# Altium project IR_SCOOTER.PrjPcb (part 4 of 4)
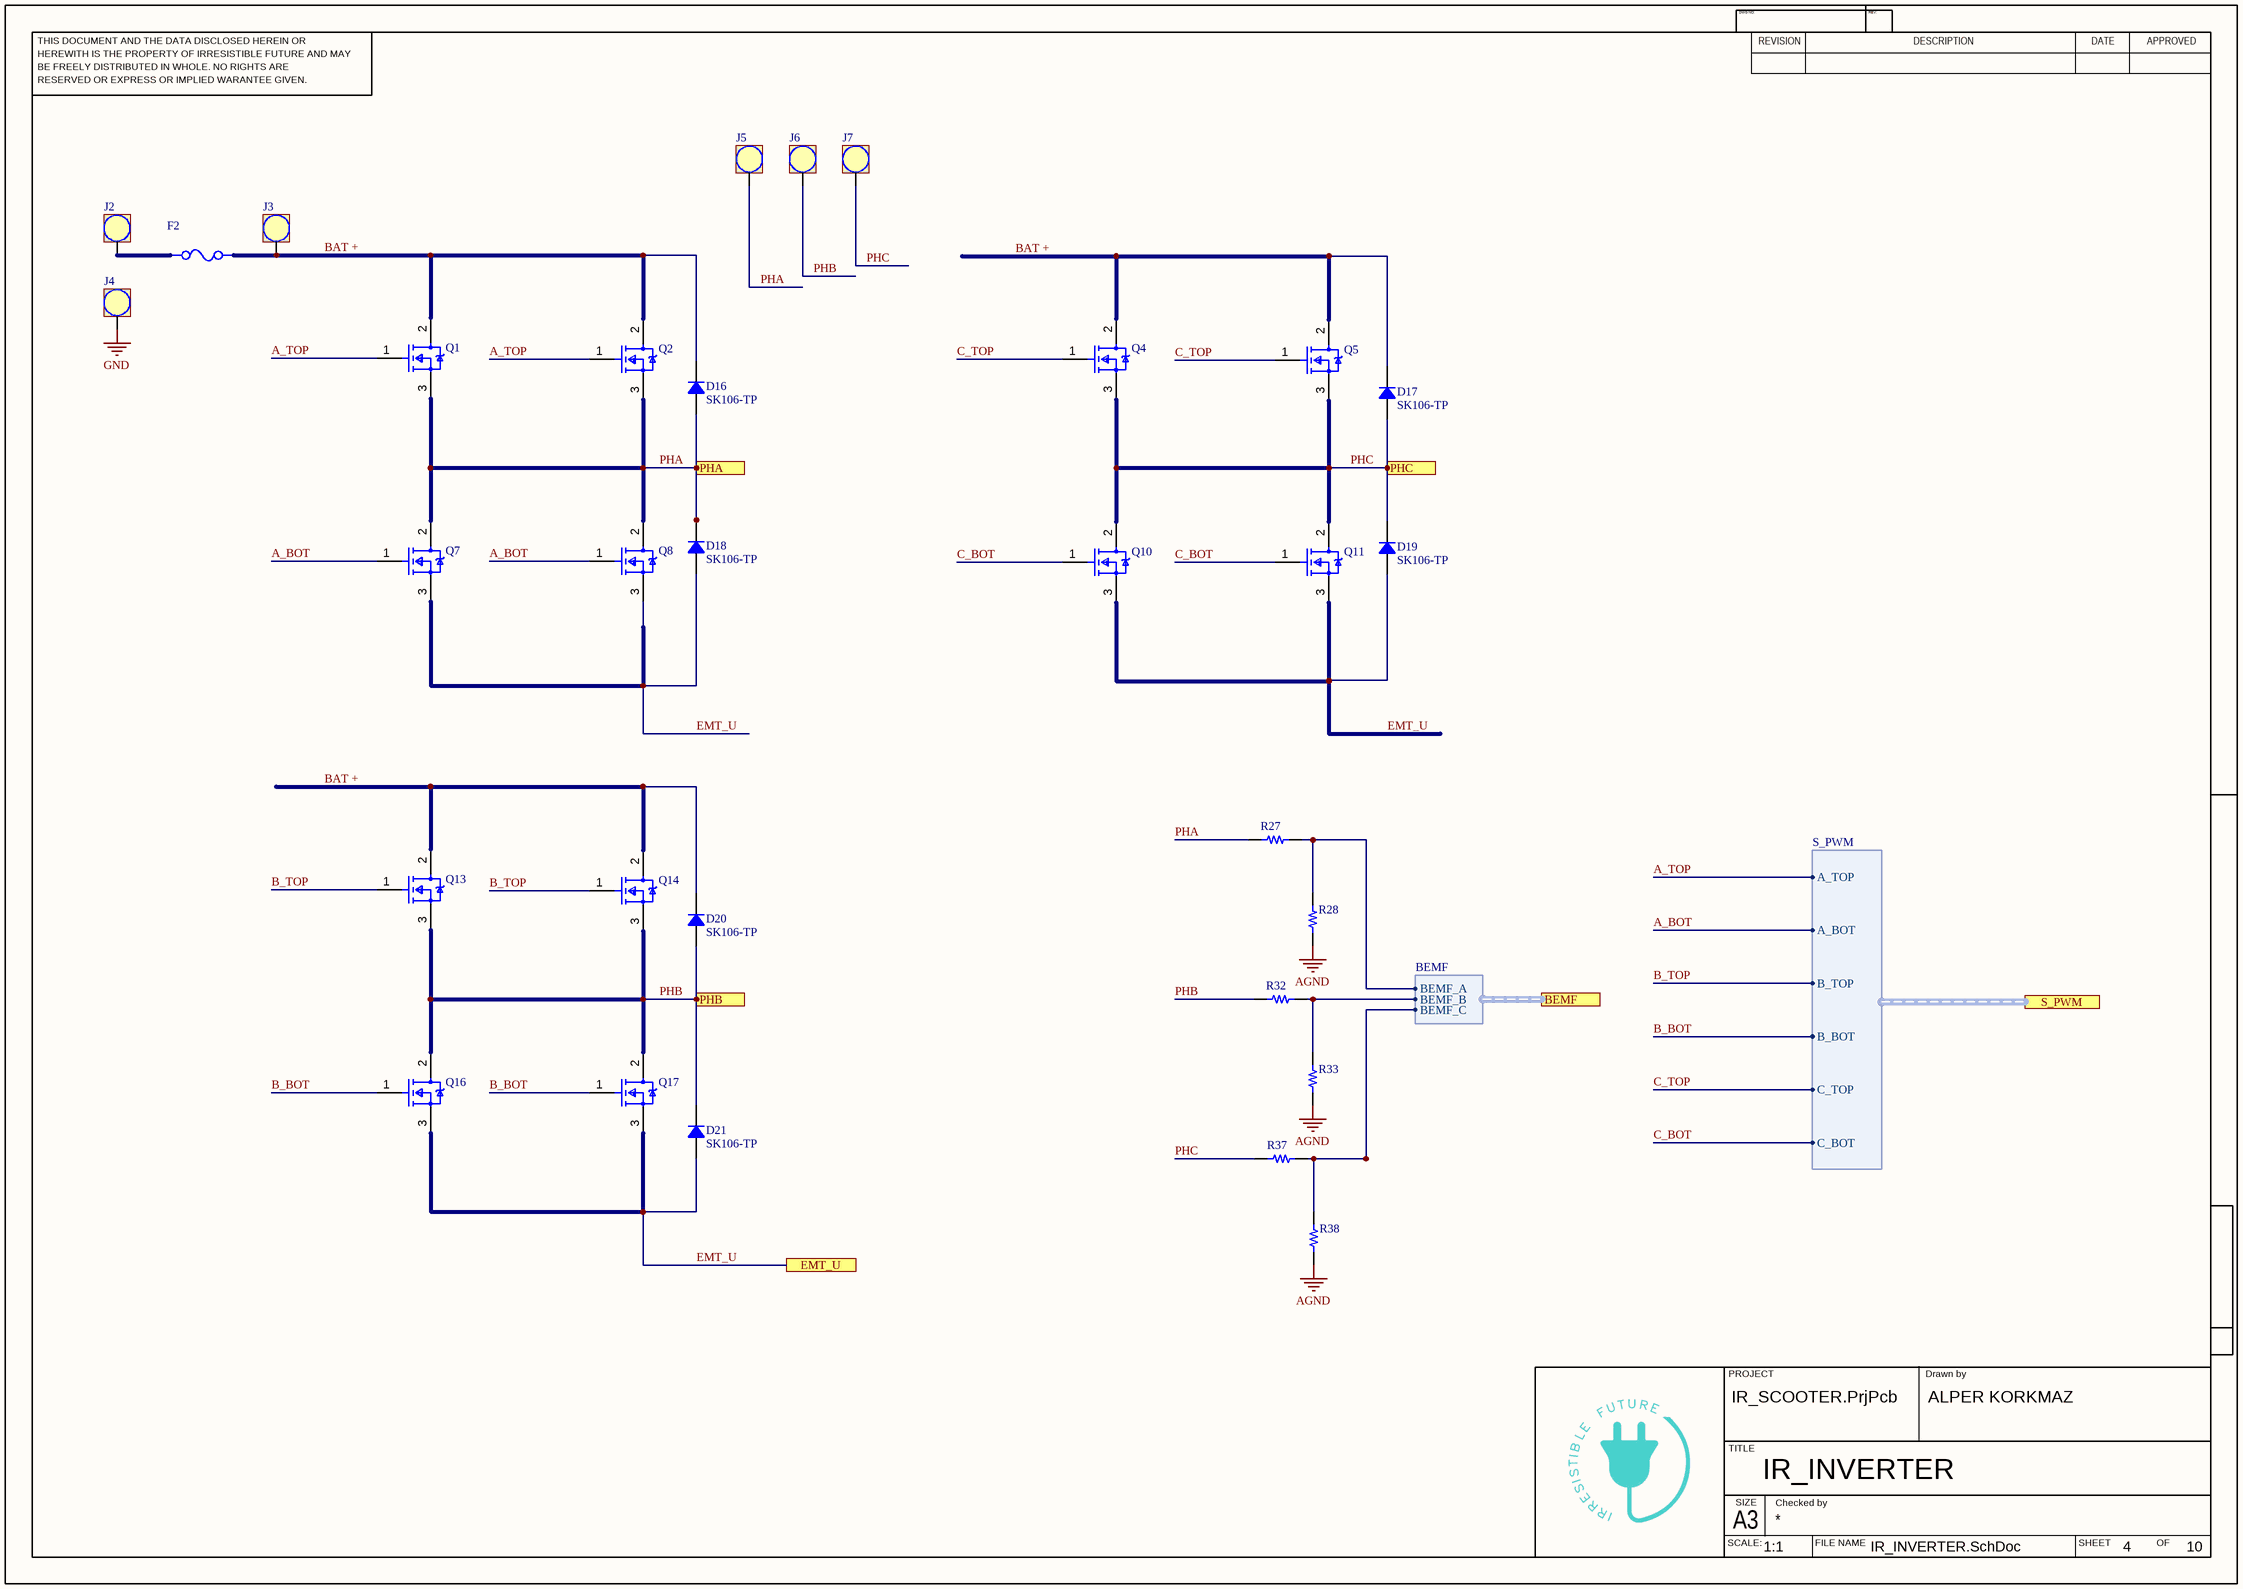
[diagram p8: IR_INVERTER.SchDoc]

## Nets that join several sheets
+3.3: IR_SCOOTER (6 pins), IR_CONTROLLER (11 pins), IR_CURRENT_SENSE (C47.1 U19.5), IR_INPUT_POWER (D2.1), IR_COMMUNICATION (8 pins)
+15: IR_INPUT_POWER (5 pins), IR_GATE_DRIVER_1 (6 pins)
AGND: IR_SCOOTER (7 pins), IR_CONTROLLER (21 pins), IR_TEMP_SENSE (U14.2 U14.4), IR_CURRENT_SENSE (6 pins), IR_INPUT_POWER (20 pins), IR_COMMUNICATION (12 pins), IR_GATE_DRIVER_1 (15 pins), IR_INVERTER (R28.1 R33.1 R38.1)
GND: IR_INPUT_POWER (7 pins), IR_INVERTER (J4#2.1)
A_BOT: IR_GATE_DRIVER_1 (6 pins), IR_INVERTER (Q7.1 Q8.1)
A_TOP: IR_GATE_DRIVER_1 (6 pins), IR_INVERTER (Q1.1 Q2.1)
B_BOT: IR_GATE_DRIVER_1 (6 pins), IR_INVERTER (Q16.1 Q17.1)
B_TOP: IR_GATE_DRIVER_1 (6 pins), IR_INVERTER (Q13.1 Q14.1)
C_BOT: IR_GATE_DRIVER_1 (6 pins), IR_INVERTER (Q10.1 Q11.1)
C_TOP: IR_GATE_DRIVER_1 (6 pins), IR_INVERTER (Q4.1 Q5.1)
Current_1: IR_CONTROLLER (U4.11), IR_CURRENT_SENSE (C49.1 R92.2)
Current_2: IR_CONTROLLER (U4.12), IR_CURRENT_SENSE (C51.2 R94.2)
Detect_Bus_Voltage: IR_CONTROLLER (U4.4), IR_INPUT_POWER (R1.2)
EMT_U: IR_GATE_DRIVER_1 (12 pins), IR_INVERTER (9 pins)
NetC12_2: IR_CONTROLLER (U4.3), IR_INPUT_POWER (C12.2 R7.2 R8.2)
NetHALL1_2: IR_SCOOTER (HALL1.2), IR_CONTROLLER (U4.37)
NetHALL1_3: IR_SCOOTER (HALL1.3), IR_CONTROLLER (U4.34)
NetHALL_1: IR_SCOOTER (HALL.1 R96.1), IR_CONTROLLER (U4.13)
NetHALL_2: IR_SCOOTER (HALL.2 R97.1), IR_CONTROLLER (U4.14)
NetHALL_3: IR_SCOOTER (HALL.3 R98.1), IR_CONTROLLER (U4.15)
NetR27_2: IR_CONTROLLER (U4.39), IR_INVERTER (R27.2 R28.2)
NetR32_2: IR_CONTROLLER (U4.40), IR_INVERTER (R32.2 R33.2)
NetR37_2: IR_CONTROLLER (U4.41), IR_INVERTER (R37.2 R38.2)
NetR69_1: IR_CONTROLLER (U4.21), IR_COMMUNICATION (R69.1 U10.2)
NetR74_1: IR_CONTROLLER (U4.46), IR_COMMUNICATION (R74.1)
NetR75_1: IR_CONTROLLER (U4.45), IR_COMMUNICATION (R75.1)
NetR81_1: IR_CONTROLLER (U4.43), IR_TEMP_SENSE (R81.1 U14.6)
NetR82_1: IR_CONTROLLER (U4.42), IR_TEMP_SENSE (R82.1 U14.1)
NetU3_4: IR_CONTROLLER (U4.33), IR_INPUT_POWER (U3.4)
NetU3_6: IR_CONTROLLER (U4.32), IR_INPUT_POWER (U3.6)
NetU4_22: IR_CONTROLLER (U4.22), IR_COMMUNICATION (U10.3)
PHA: IR_GATE_DRIVER_1 (C28.1 R26.1 R49.1 U7.11), IR_INVERTER (8 pins)
PHB: IR_GATE_DRIVER_1 (C38.1 R20.1 R64.1 U9.11), IR_INVERTER (8 pins)
PHC: IR_GATE_DRIVER_1 (C29.1 R17.1 R50.1 U8.11), IR_INVERTER (8 pins)
PWM_A_BOT: IR_CONTROLLER (U4.17), IR_GATE_DRIVER_1 (R43.1)
PWM_A_TOP: IR_CONTROLLER (U4.29), IR_GATE_DRIVER_1 (R40.1)
PWM_B_BOT: IR_CONTROLLER (U4.18), IR_GATE_DRIVER_1 (R61.1)
PWM_B_TOP: IR_CONTROLLER (U4.30), IR_GATE_DRIVER_1 (R60.1)
PWM_C_BOT: IR_CONTROLLER (U4.19), IR_GATE_DRIVER_1 (R44.1)
PWM_C_TOP: IR_CONTROLLER (U4.31), IR_GATE_DRIVER_1 (R42.1)
~{RST}: IR_SCOOTER (HALL1.4), IR_CONTROLLER (C21.2 R12.1 U4.7)